# Altium schematic sheet Analyzer_BlockDiagram.SchDoc
size A3; SheetNumber: 1; SheetTotal: 2
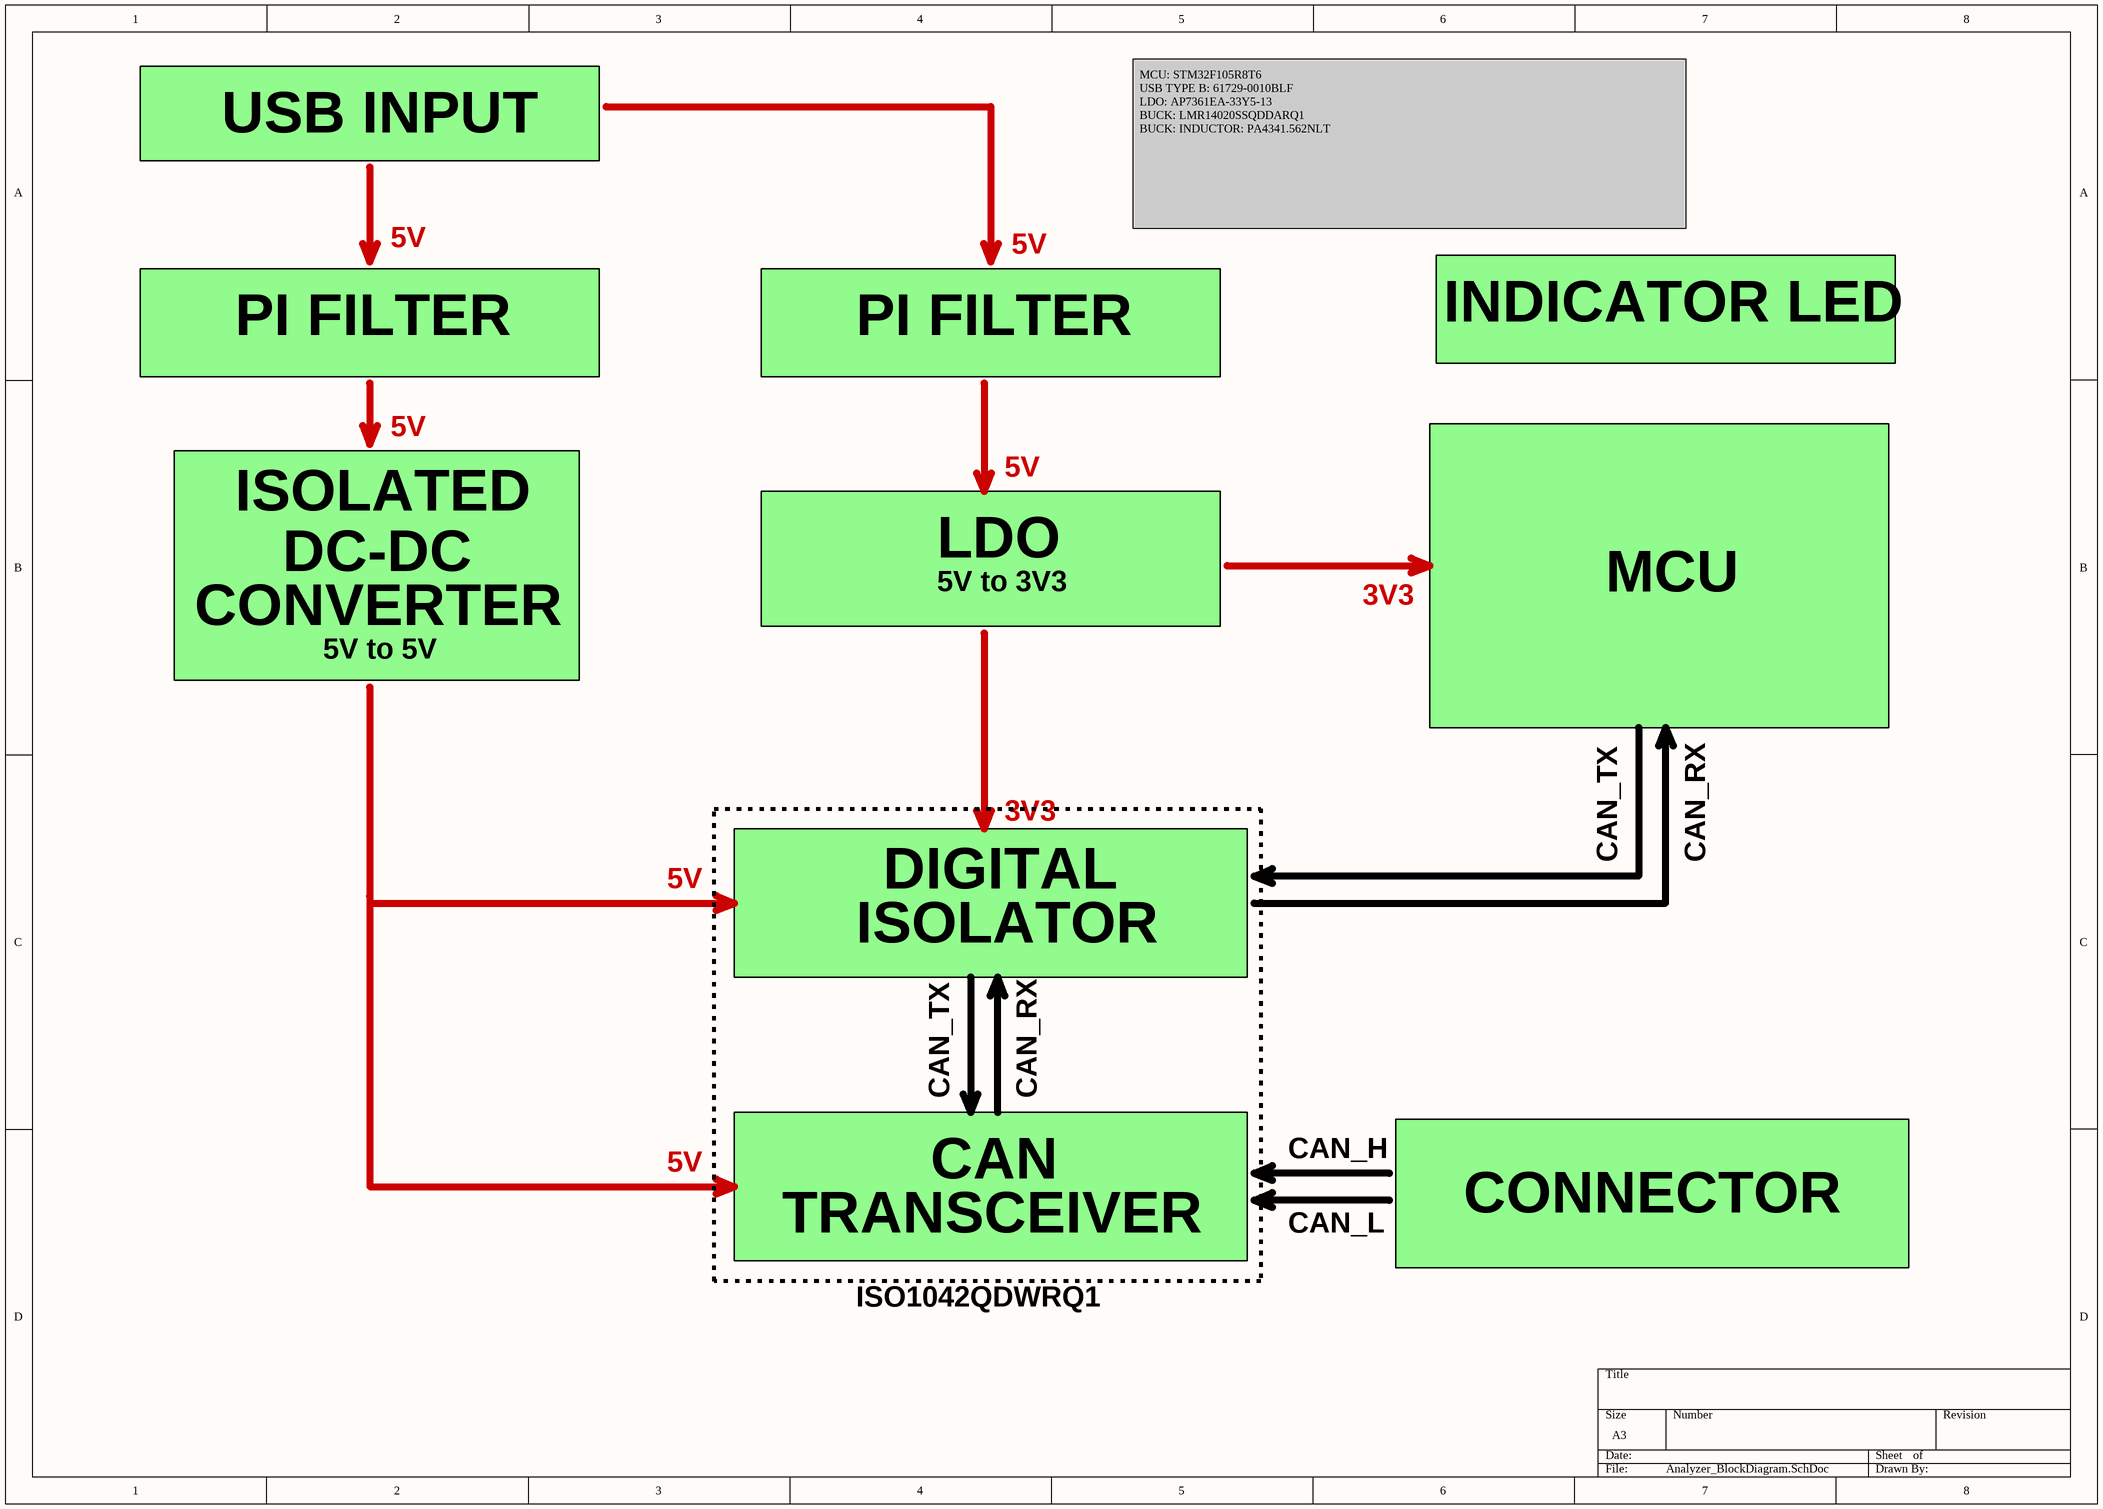
[diagram p0: Analyzer_BlockDiagram.SchDoc]

## Notes on the sheet
- USB INPUT
- MCU: STM32F105R8T6
  USB TYPE B: 61729-0010BLF
  LDO: AP7361EA-33Y5-13
  BUCK: LMR14020SSQDDARQ1
  BUCK: INDUCTOR: PA4341.562NLT
- 5V
- PI FILTER
- INDICATOR LED
- ISOLATED
- DC-DC
- LDO
- CONVERTER
- 5V to 3V3
- 3V3
- MCU
- 5V to 5V
- CAN_TX
- CAN_RX
- DIGITAL
- ISOLATOR
- CAN
- CAN_H
- TRANSCEIVER
- CAN_L
- CONNECTOR
- ISO1042QDWRQ1